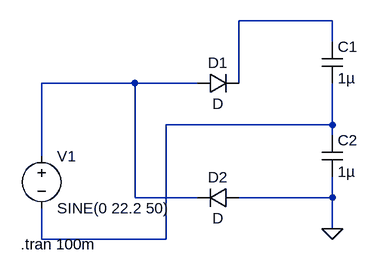
[diagram p0: schematic Voltage doubler circuit.asc]
Voltage doubler circuit.asc, the LTspice schematic file:
Version 4
SHEET 1 880 680
WIRE 432 -112 288 -112
WIRE 432 -80 432 -112
WIRE 128 -16 -16 -16
WIRE 224 -16 128 -16
WIRE 288 -16 288 -112
WIRE 432 48 432 -16
WIRE 432 48 176 48
WIRE 432 64 432 48
WIRE -16 96 -16 -16
WIRE 128 160 128 -16
WIRE 224 160 128 160
WIRE 432 160 432 128
WIRE 432 160 288 160
WIRE 432 208 432 160
WIRE -16 224 -16 176
WIRE 176 224 176 48
WIRE 176 224 -16 224
FLAG 432 208 0
SYMBOL voltage -16 80 R0
WINDOW 123 0 0 Left 0
WINDOW 39 0 0 Left 0
SYMATTR InstName V1
SYMATTR Value SINE(0 22.2 50)
SYMBOL diode 224 -32 M90
WINDOW 0 0 32 VBottom 2
WINDOW 3 32 32 VTop 2
SYMATTR InstName D1
SYMBOL diode 288 144 R90
WINDOW 0 0 32 VBottom 2
WINDOW 3 32 32 VTop 2
SYMATTR InstName D2
SYMBOL cap 416 -80 R0
SYMATTR InstName C1
SYMATTR Value 1µ
SYMBOL cap 416 64 R0
SYMATTR InstName C2
SYMATTR Value 1µ
TEXT -48 232 Left 2 !.tran 100m

The netlist it stands for:
* Voltage doubler circuit.asc
V1 N002 N003 SINE(0 22.2 50)
D1 N002 N001 D
D2 0 N002 D
C1 N001 N003 1µ
C2 N003 0 1µ
.model D D
.lib standard.dio
.tran 100m
.backanno
.end